# EAGLE design numeric2 (EAGLE 7.7.0)
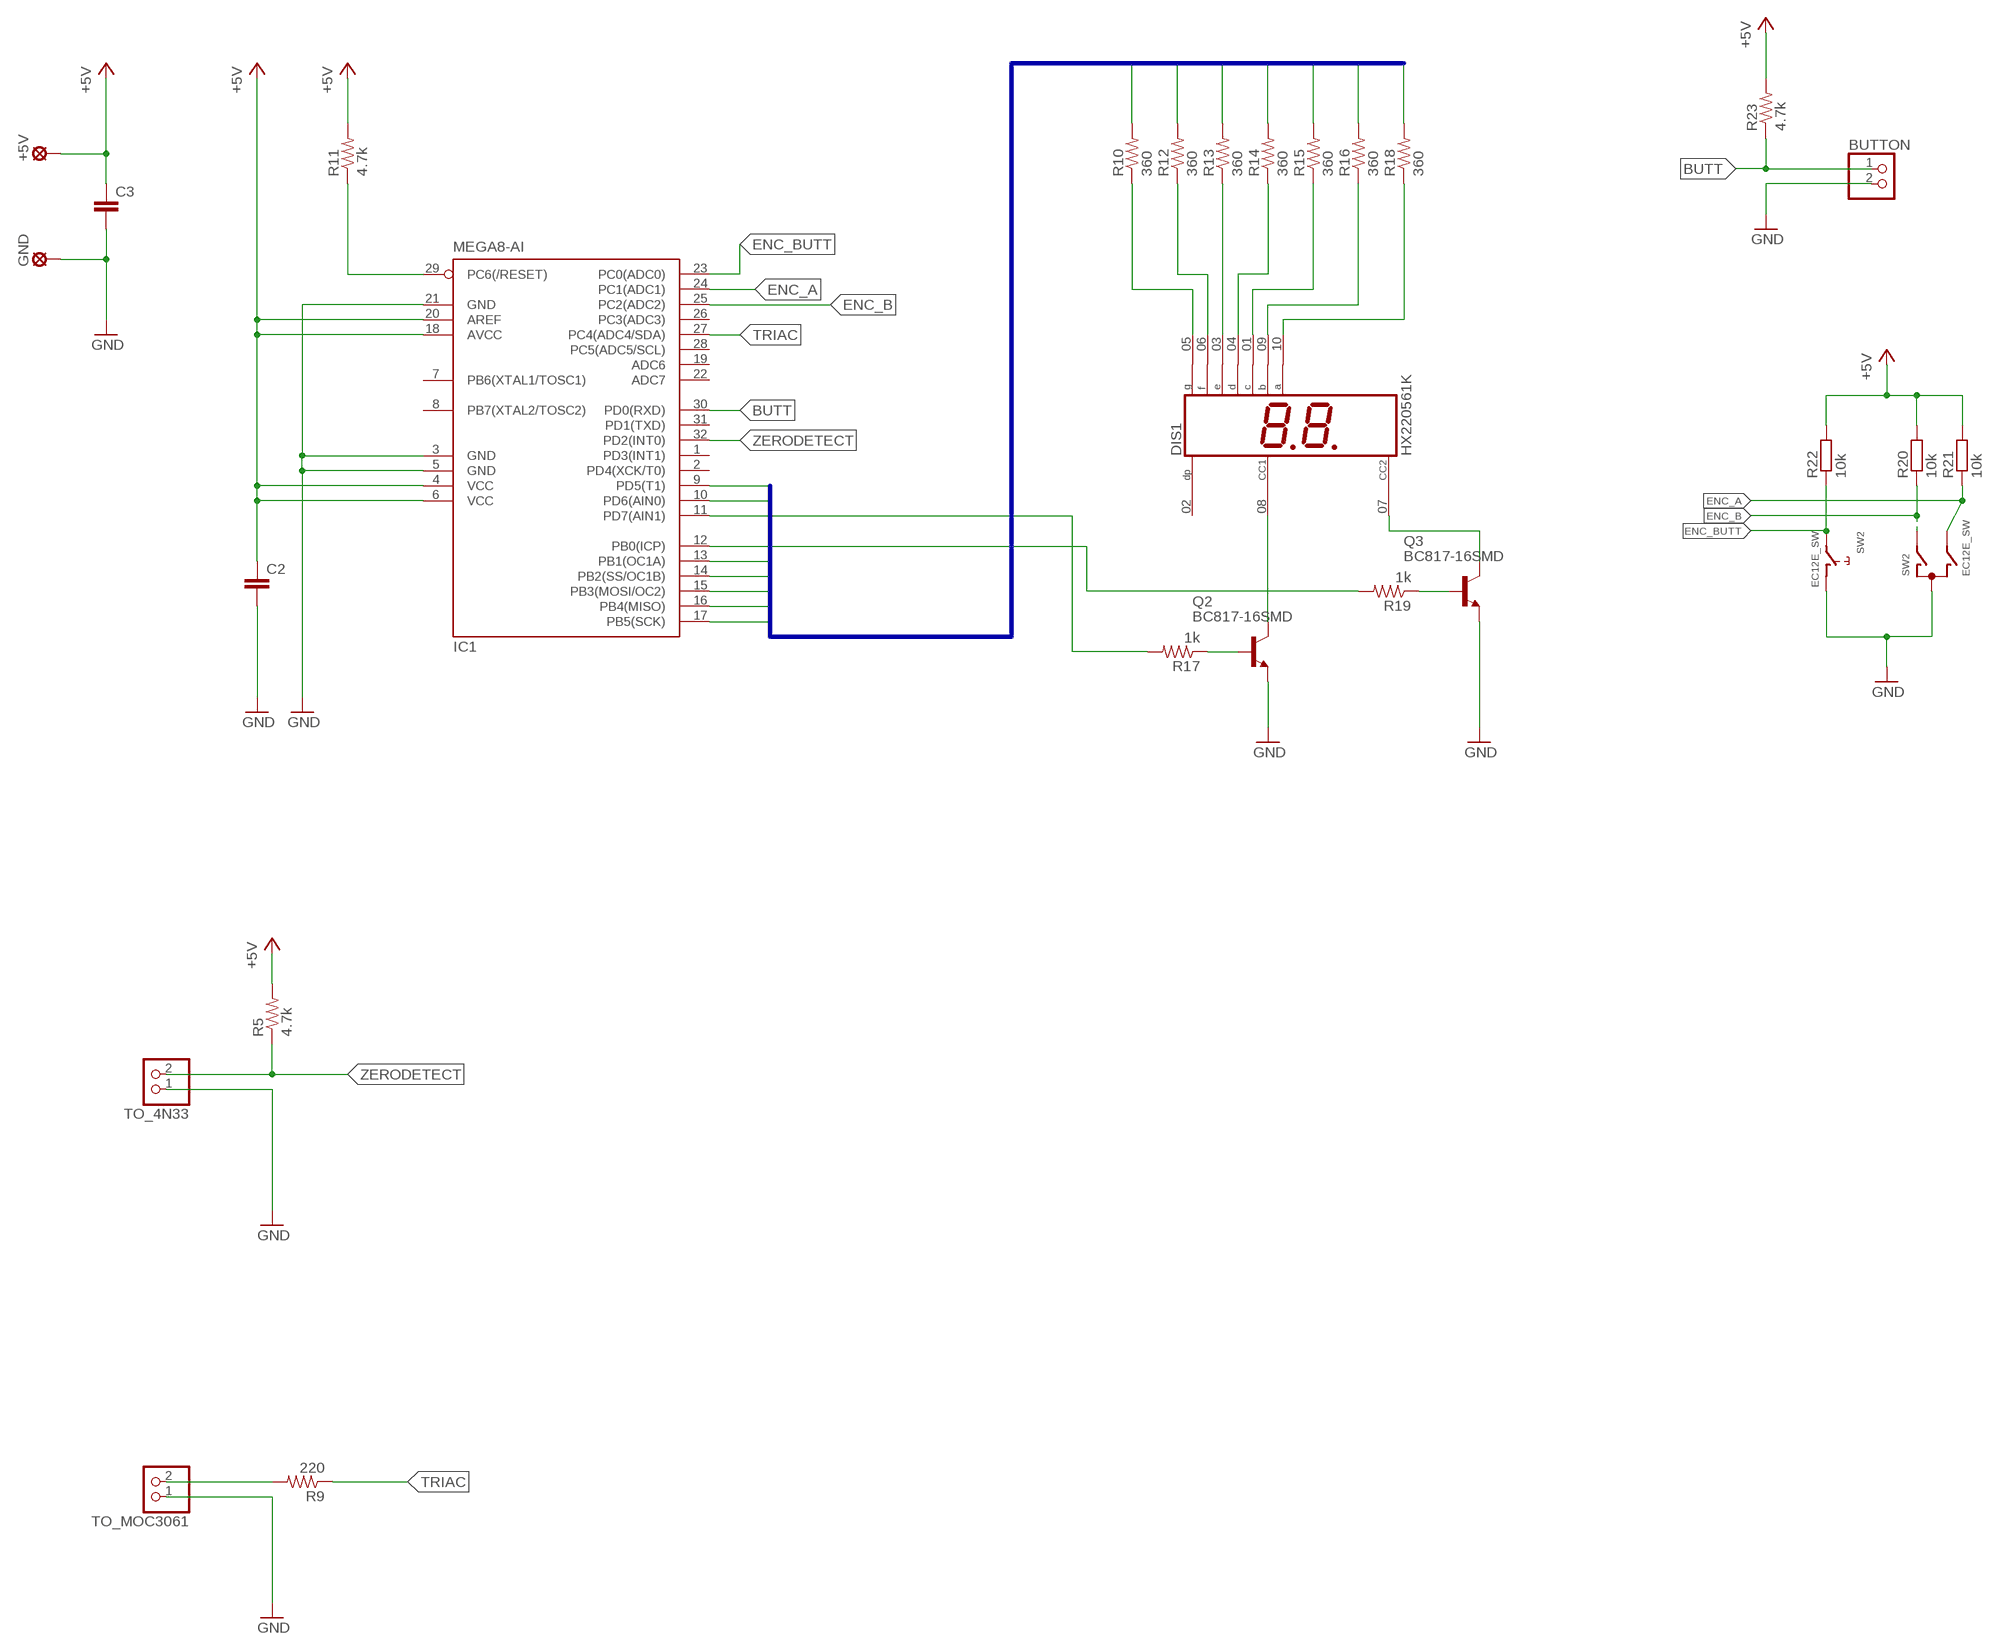
[diagram p0: schematic, sheet 1]

## Parts
+5V  LSP10  [LSP10]
BUTTON  PINHD-1X2  [1X02]
C2  C-EUC1210K  [C1210K]
C3  C-EUC1210K  [C1210K]
DIS1  HX220561K  [HX220561K]
GND  LSP10  [LSP10]
IC1  MEGA8-AI  [TQFP32-08]
Q2  BC817-16SMD  [SOT23-BEC]
Q3  BC817-16SMD  [SOT23-BEC]
R5  4.7k  R-US_M1206  [M1206]
R9  220  R-US_M1206  [M1206]
R10  360  R-US_M1206  [M1206]
R11  4.7k  R-US_M1206  [M1206]
R12  360  R-US_M1206  [M1206]
R13  360  R-US_M1206  [M1206]
R14  360  R-US_M1206  [M1206]
R15  360  R-US_M1206  [M1206]
R16  360  R-US_M1206  [M1206]
R17  1k  R-US_M1206  [M1206]
R18  360  R-US_M1206  [M1206]
R19  1k  R-US_M1206  [M1206]
R20  10k  R-EU_R1206  [R1206]
R21  10k  R-EU_R1206  [R1206]
R22  10k  R-EU_R1206  [R1206]
R23  4.7k  R-US_M1206  [M1206]
SW2  EC12E_SW  [ALPS_EC12E_SW]
TO_4N33  PINHD-1X2  [1X02]
TO_MOC3061  PINHD-1X2  [1X02]

## Nets
+5V: +5V.MP C2.1 C3.1 IC1.4(VCC) IC1.6(VCC) IC1.18(AVCC) IC1.20(AREF) R5.2 R11.2 R20.2 R21.2 R22.2 R23.2
B0: IC1.10(PD6(AIN0)) R16.2
B1: IC1.9(PD5(T1)) R18.2
B2: IC1.13(PB1(OC1A)) R15.2
B3: IC1.14(PB2(SS/OC1B)) R13.2
B4: IC1.15(PB3(MOSI/OC2)) R14.2
B5: IC1.16(PB4(MISO)) R10.2
B6: IC1.17(PB5(SCK)) R12.2
BUTT: BUTTON.1 IC1.30(PD0(RXD)) R23.1
ENC_A: IC1.24(PC1(ADC1)) R21.1 SW2.B
ENC_B: IC1.25(PC2(ADC2)) R20.1 SW2.A
ENC_BUTT: IC1.23(PC0(ADC0)) R22.1 SW2.E(BUTT)
GND: BUTTON.2 C2.2 C3.2 GND.MP IC1.3(GND) IC1.5(GND) IC1.21(GND) Q2.E Q3.E SW2.C SW2.GND@1(BUTT_GND) TO_4N33.1 TO_MOC3061.1
N$1: IC1.12(PB0(ICP)) R19.2
N$2: IC1.11(PD7(AIN1)) R17.2
N$13: IC1.29(PC6(/RESET)) R11.1
N$14: DIS1.05(G) R10.1
N$15: DIS1.06(F) R12.1
N$16: DIS1.03(E) R13.1
N$17: DIS1.04(D) R14.1
N$18: DIS1.01(C) R15.1
N$19: DIS1.09(B) R16.1
N$20: DIS1.10(A) R18.1
N$21: DIS1.08(CC1) Q2.C
N$22: DIS1.07(CC2) Q3.C
N$23: Q3.B R19.1
N$24: Q2.B R17.1
N$30: R9.2 TO_MOC3061.2
TRIAC: IC1.27(PC4(ADC4/SDA)) R9.1
ZERODETECT: IC1.32(PD2(INT0)) R5.1 TO_4N33.2
Unconnected: DIS1.02(DP) IC1.1(PD3(INT1)) IC1.2(PD4(XCK/T0)) IC1.7(PB6(XTAL1/TOSC1)) IC1.8(PB7(XTAL2/TOSC2)) IC1.19(ADC6) IC1.22(ADC7) IC1.26(PC3(ADC3)) IC1.28(PC5(ADC5/SCL)) IC1.31(PD1(TXD)) SW2.GND@2(GND) SW2.GND@3(GND)

## Buses
B[0..6]

## Library data of the parts
+5V GND = solpad:LSP10: SOLDER PAD drill 1.0 mm, distributor Buerklin, 12H555
BUTTON TO_4N33 TO_MOC3061 = pinhead:PINHD-1X2: PIN HEADER
C2 C3 = rcl:C-EU: CAPACITOR, European symbol
DIS1 = hx22053k:HX220561K: LED DISPLAY 2 x 1 character 7 segment, decimal points right
IC1 = atmel:MEGA8: MICROCONTROLLER 8 Kbytes FLASH, 1 kbytes SRAM, 512 bytes EEPROM, USART, 6-channel 10 bit ADC, 2-channel 8 bit ADC Pin compatible with Atmega48, ATMega88, ATMega168 Source: avr.lbr; MPN: ATMEGA8-16AU; OC_FARNELL: 9171371; OC_NEWARK: 73M8863
Q2 Q3 = transistor-npn:BC817*: NPN Transistor
R5 R9-R19 R23 = rcl:R-US_: RESISTOR, American symbol
R20-R22 = rcl:R-EU_: RESISTOR, European symbol
SW2 = switch-alps:EC12E_SW: ALPS rotary Encoder EC12E series with switch; MPN: EC12E2424407; OC_FARNELL: 1520813; OC_NEWARK: 74M1068

## Board
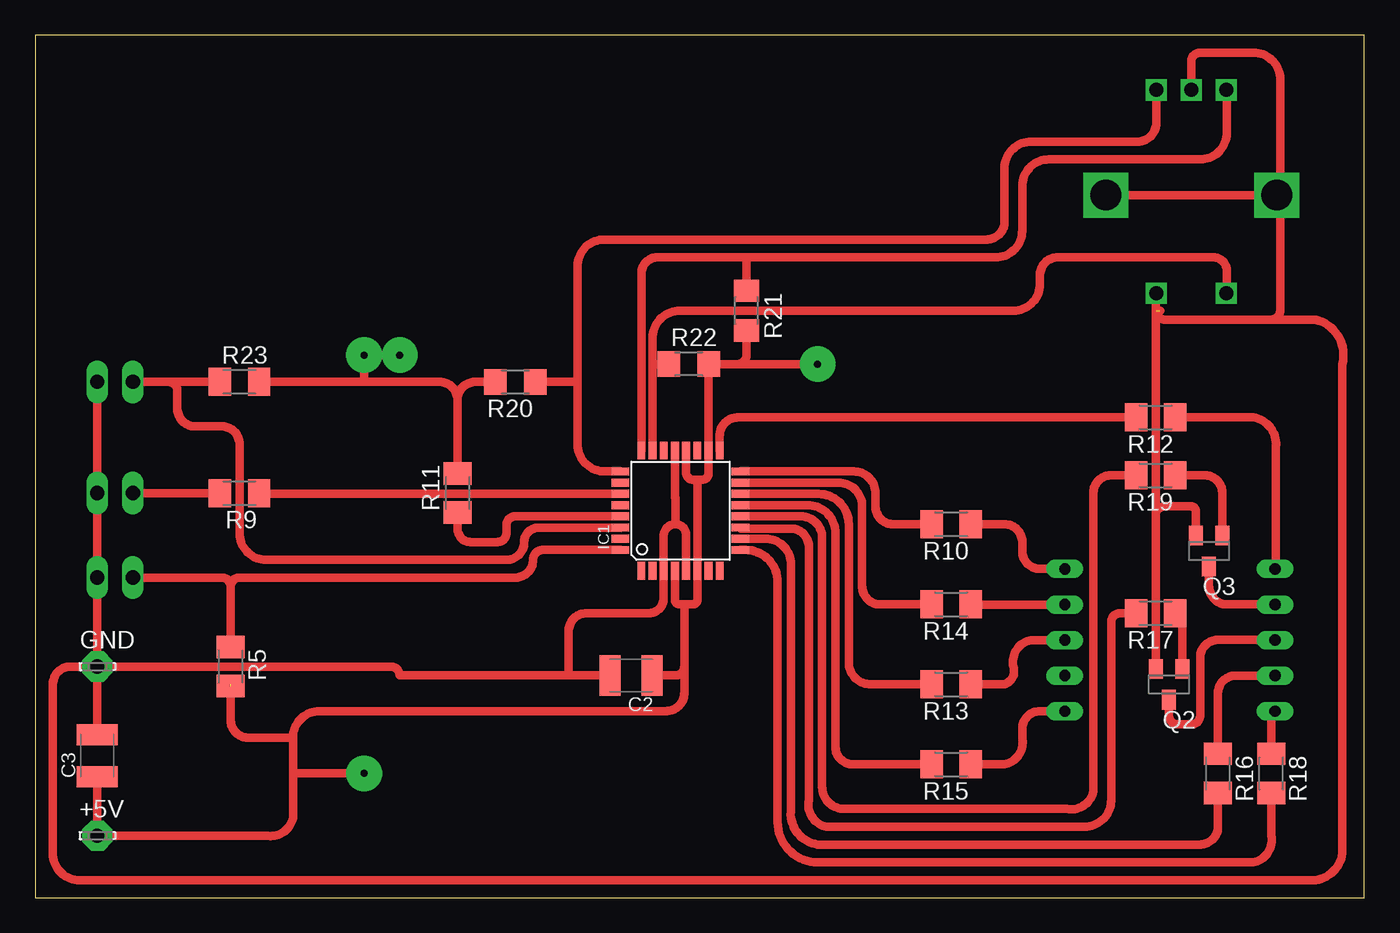
[diagram p1: board, top side]
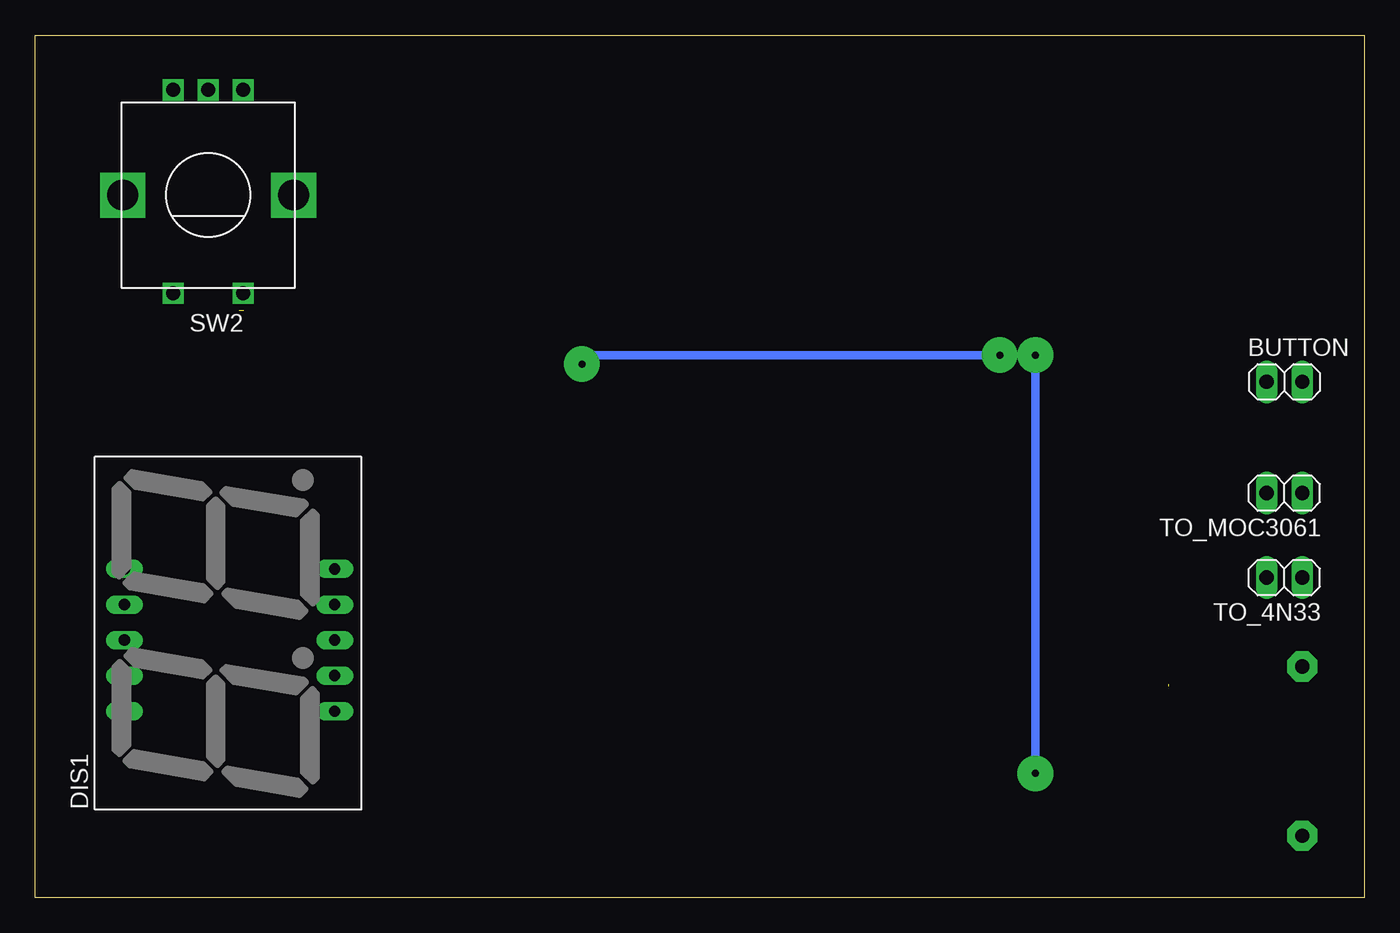
[diagram p2: board, bottom side, seen from below]

Size 94.92 x 61.59 mm. Coordinates in mm from the lower left corner, seen from the top.
Outline: 0,0 94.92,0 94.92,61.59 0,61.59 0,0
Copper layers (1*16): Top 0.035mm / dielectric 1.5mm / Bottom 0.035mm
Design rules "default": minimum track width 10mil, minimum drill 24mil, track to track 8mil, track to pad 8mil, pad to pad 8mil, via to via 8mil, smd to smd 8mil, copper to edge 40mil, drill to drill 8mil, minimum pad ring 10mil, minimum via ring 8mil, stop-mask expansion 4mil, vias tented up to drill 0mil, thermal gap 10mil

### Footprints (pad centres in the part's own frame; a part is rotated, then mirrored left to right if it is on the bottom)
LSP10 = drill 1.016 pad 2.159 octagon: MP 0,0
1X02 = drill 1.016 long: 1 -1.27,0; 2 1.27,0
C1210K = smd 1.5 x 2.9: 1 -1.5,0; 2 1.5,0
HX220561K = drill 0.813 long: 01 -12.08,-7.12; 02 -9.54,-7.12; 03 -7,-7.12; 04 -4.46,-7.12; 05 -1.92,-7.12; 06 -1.92,7.88; 07 -4.46,7.88; 08 -7,7.88; 09 -9.54,7.88; 10 -12.08,7.88
TQFP32-08 = smd 1.27 x 0.559: 1 -4.293,2.8; 2 -4.293,2; 3 -4.293,1.2; 4 -4.293,0.4; 5 -4.293,-0.4; 6 -4.293,-1.2; 7 -4.293,-2; 8 -4.293,-2.8; 17 4.293,-2.8; 18 4.293,-2; 19 4.293,-1.2; 20 4.293,-0.4; 21 4.293,0.4; 22 4.293,1.2; 23 4.293,2; 24 4.293,2.8 | smd 0.559 x 1.27: 9 -2.8,-4.293; 10 -2,-4.293; 11 -1.2,-4.293; 12 -0.4,-4.293; 13 0.4,-4.293; 14 1.2,-4.293; 15 2,-4.293; 16 2.8,-4.293; 25 2.8,4.293; 26 2,4.293; 27 1.2,4.293; 28 0.4,4.293; 29 -0.4,4.293; 30 -1.2,4.293; 31 -2,4.293; 32 -2.8,4.293
SOT23-BEC = smd 1 x 1.4: B -0.95,-1.1; C 0,1.1; E 0.95,-1.1
M1206 = smd 1.6 x 2: 1 -1.4,0; 2 1.4,0
R1206 = smd 1.6 x 1.803: 1 -1.422,0; 2 1.422,0
ALPS_EC12E_SW = drill 1 square: A -2.5,-7.5; B 2.5,-7.5; C 0,-7.5; E 2.5,7; GND@1 -2.5,7 | drill 2.2 square: GND@2 -6.1,0; GND@3 6.1,0

### Placement (x,y rotation side)
+5V  4.45,4.45 0 top
BUTTON  5.71,36.83 0 bottom
C2  42.55,15.88 180 top
C3  4.45,10.16 90 top
DIS1  80.64,25.4 90 bottom
GND  4.45,16.51 0 top
IC1  46.09,27.64 90 top
Q2  80.96,15.24 180 top
Q3  83.82,24.77 180 top
R5  13.97,16.51 270 top
R9  14.61,28.89 180 top
R10  65.41,26.67 180 top
R11  30.16,28.89 90 top
R12  80.01,34.29 180 top
R13  65.41,15.24 180 top
R14  65.41,20.95 180 top
R15  65.41,9.53 180 top
R16  84.45,8.89 270 top
R17  80.01,20.32 180 top
R18  88.27,8.89 270 top
R19  80.01,30.16 180 top
R20  34.29,36.83 180 top
R21  50.8,41.91 270 top
R22  46.67,38.1 0 top
R23  14.61,36.83 0 top
SW2  82.55,50.16 180 bottom
TO_4N33  5.71,22.86 180 bottom
TO_MOC3061  5.71,28.89 180 bottom

### Tracks (layer width: path | path; a pad name or v marks a point on that pad's centre or on a via)
+5V  (via drill 0.5 pad 2.54)  (1 unrouted)
  Top 0.61: IC1.20 46.48,30.35 arc90 46.99,29.84 | 46.99,29.84 47.62,29.84 arc90 48.09,30.3 IC1.18 R22.2 50.16,38.1 | 50.16,38.1 arc90 50.8,38.73 R21.2 | 46.99,29.84 arc-90 47.28,29.55 IC1.6 47.28,21.25 arc-90 46.99,20.95 46.35,20.95 | IC1.4 45.69,21.31 arc90 46.04,20.95 46.35,20.95 | C2.1 45.72,15.88 arc90 46.35,16.51 | 46.35,16.51 46.35,20.95 | C3.1 +5V.MP 16.51,4.45 arc90 18.41,5.71 18.41,8.89 | 46.35,16.51 46.35,14.61 arc-90 45.09,13.34 20.32,13.34 arc90 18.41,11.43 | 18.41,11.43 18.41,8.89 | 18.41,11.43 15.24,11.43 arc-90 13.97,12.7 13.97,15.24 | 30.16,35.56 R11.2 | R23.2 23.5,36.83 | 23.5,36.83 28.89,36.83 arc-90 30.16,35.56 | 18.41,8.89 v23.5,8.89 | 23.5,36.83 v23.5,38.73 v26.04,38.73 | v55.88,38.1 50.16,38.1 | R20.2 31.43,36.83 arc90 30.16,35.56
  Bottom 0.61: v23.5,8.89 v23.5,38.73 | v26.04,38.73 55.88,38.73 arc-90 v55.88,38.1
B0
  Top 0.61: R16.2 84.45,5.08 arc-90 83.19,3.81 55.88,3.81 arc-90 53.98,6.35 53.98,23.81 arc90 52.15,25.64 IC1.10
B1
  Top 0.61: R18.2 88.27,4.45 arc-90 87,2.54 55.88,2.54 arc-90 53.02,5.4 53.02,22.54 arc90 50.73,24.84 IC1.9
B2
  Top 0.61: IC1.13 55.15,28.04 arc-90 57.15,26.04 57.15,10.79 arc90 58.42,9.53 R15.2
B3
  Top 0.61: IC1.14 55.94,28.84 arc-90 58.1,26.67 58.1,16.83 arc90 59.69,15.24 R13.2
B4
  Top 0.61: R14.2 60.33,20.95 arc-90 59.05,22.23 59.05,27.94 arc90 57.36,29.64 IC1.15
B5
  Top 0.61: IC1.16 58.47,30.43 arc-90 60.01,28.89 60.01,27.94 arc90 61.28,26.67 R10.2
B6
  Top 0.61: IC1.17 48.88,33.01 arc-90 50.16,34.29 R12.2
BUTT
  Top 0.61: BUTTON.1 9.53,36.83 | 9.53,36.83 R23.1 | IC1.30 35.96,26.43 arc90 34.92,25.4 arc-90 33.66,24.13 16.51,24.13 arc-90 14.61,26.04 14.61,32.38 arc90 13.34,33.66 11.43,33.66 arc-90 10.16,34.92 10.16,36.2 arc90 9.53,36.83
ENC_A
  Top 0.61: IC1.24 43.28,44.55 arc-90 44.45,45.72 50.8,45.72 | SW2.B arc-90 85.09,57.62 85.09,54.61 arc-90 83.19,52.7 72.39,52.7 arc90 70.48,50.8 70.48,47.62 arc-90 68.58,45.72 50.8,45.72 | R21.1 50.8,45.72
ENC_B
  Top 0.61: SW2.A 80.05,55.28 arc-90 78.74,53.98 71.12,53.98 arc90 69.22,52.07 69.22,48.26 arc-90 67.94,46.99 40.64,46.99 arc90 38.73,45.09 38.73,36.83 | IC1.25 40.69,30.43 arc-90 38.73,32.38 38.73,36.83 | R20.1 38.73,36.83
ENC_BUTT
  Top 0.61: IC1.23 44.09,38.1 | 44.09,38.1 44.09,39.96 arc-90 46.04,41.91 69.85,41.91 arc90 71.75,43.81 71.75,44.45 arc-90 73.03,45.72 84.14,45.72 arc-90 85.09,44.77 85.09,43.2 arc-90 SW2.E | R22.1 44.09,38.1
GND  (1 unrouted)
  Top 0.61: 80.33,41.91 arc90 80.33,41.91 | 88.9,50.16 88.9,58.42 arc90 87,60.33 83.19,60.33 arc90 82.55,59.69 SW2.C | 88.9,50.16 88.9,41.91 arc-90 88.27,41.27 | 76.2,50.16 88.9,50.16 | IC1.21 45.69,28.61 arc90 45.72,28.57 45.72,26.67 | IC1.5 46.48,25.91 arc90 45.72,26.67 | 45.72,26.67 arc90 44.88,25.84 IC1.3 44.88,21.39 arc-90 43.81,20.32 39.37,20.32 arc90 38.1,19.05 38.1,15.88 | 38.1,15.88 C2.2 | GND.MP 25.4,16.51 arc-90 26.04,15.88 38.1,15.88 | GND.MP C3.2 | BUTTON.2 TO_MOC3061.1 TO_4N33.1 GND.MP | 88.27,41.27 91.44,41.27 arc-90 93.34,38.1 93.34,3.17 arc-90 90.81,1.27 3.17,1.27 arc-90 1.27,3.17 1.27,15.24 arc-90 2.54,16.51 GND.MP | Q2.E 80.01,27.3 | 80.01,27.3 80.01,40.64 | 80.01,40.64 arc90 80.01,40.64 | Q3.E 82.87,27.62 arc90 82.55,27.94 80.65,27.94 arc90 80.01,27.3 | 80.01,40.64 80.01,41.91 | 80.01,41.91 80.01,43.13 arc-90 SW2.GND@1 | 88.27,41.27 80.65,41.27 arc-90 80.01,41.91
N$1
  Top 0.61: R19.2 76.83,30.16 arc90 75.56,28.89 75.56,7.62 arc-90 73.66,6.35 57.78,6.35 arc-90 56.2,7.94 56.2,25.72 arc90 54.68,27.23 IC1.12
N$2
  Top 0.61: R17.2 77.47,20.32 arc90 76.83,19.68 76.83,6.99 arc-90 74.93,5.08 56.52,5.08 arc-90 55.24,6.99 55.24,25.08 arc90 53.98,26.35 50.46,26.35 arc-90 IC1.11
N$13
  Top 0.61: IC1.29 34.29,27.23 arc90 33.66,26.6 33.66,26.04 arc-90 33.02,25.4 31.11,25.4 arc-90 30.16,26.35 R11.1
N$14
  Top 0.61: DIS1.05 71.77,23.48 arc-90 70.48,24.77 70.48,25.4 arc90 69.22,26.67 R10.1
N$15
  Top 0.61: R12.1 87,34.29 arc-90 88.58,32.07 88.58,23.54 arc-90 DIS1.06
N$16
  Top 0.61: DIS1.03 71.11,18.4 arc90 69.85,16.51 arc-90 69.22,15.24 R13.1
N$17
  Top 0.61: DIS1.04 R14.1 arc-90 R14.1
N$18
  Top 0.61: DIS1.01 71.74,13.32 arc90 70.48,12.06 70.48,11.43 arc-90 69.22,9.53 R15.1
N$19
  Top 0.61: DIS1.09 85.71,15.86 arc90 84.45,14.61 R16.1
N$20
  Top 0.61: R18.1 88.27,13.06 arc-90 DIS1.10
N$21
  Top 0.61: 80.96,13.65 Q2.C 80.96,13.02 arc90 81.6,12.38 82.55,12.38 arc90 83.19,13.02 83.19,17.14 arc-90 84.45,18.41 88.51,18.41 arc-90 DIS1.08
N$22
  Top 0.61: Q3.C 83.82,22.23 arc90 85.09,20.95 88.51,20.95 arc-90 DIS1.07
N$23
  Top 0.61: R19.1 83.5,30.16 arc-90 84.77,28.89 Q3.B arc-90 Q3.B
N$24
  Top 0.61: Q2.B 81.91,19.82 arc90 R17.1
N$30
  Top 0.61: TO_MOC3061.2 R9.2
TRIAC
  Top 0.61: IC1.27 16.38,28.84 arc-90 R9.1
ZERODETECT
  Top 0.61: TO_4N33.2 13.34,22.86 arc-90 13.97,22.23 | 13.97,22.23 R5.1 | IC1.32 36.27,24.84 arc90 35.56,24.13 arc-90 34.29,22.86 14.61,22.86 arc90 13.97,22.23